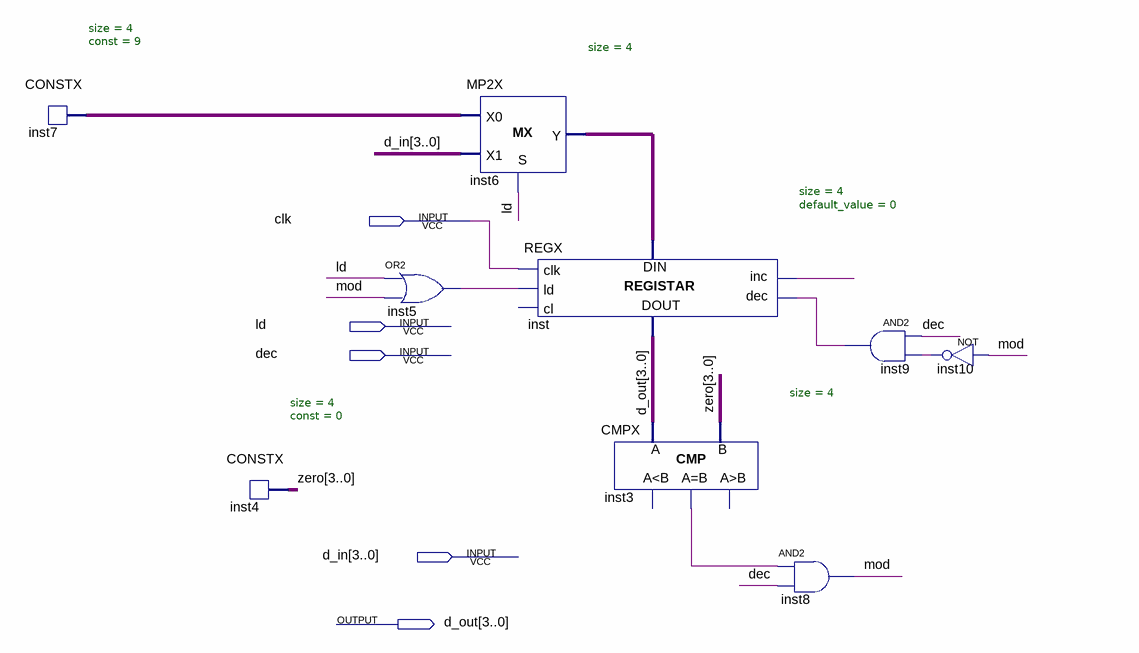
[diagram p0: schematic sheet]
// Quartus schematic RegMod9IncDec.bdf as structural Verilog: 9 symbols, 5 pins
module RegMod9IncDec (
  input  clk,
  input  ld,
  input  dec,
  input  [3:0] d_in,
  output [3:0] d_out
);

  wire inst3_eq, inst5_out, inst9_out, inst10_out, mod, undriven;
  wire [3:0] inst6_y, inst7_data, zero;

  CONSTX #(.size(4), .\const (9)) inst7 (.data(inst7_data));
  CONSTX #(.size(4), .\const (0)) inst4 (.data(zero));
  or inst5 (inst5_out, ld, mod);
  MP2X #(.size(4)) inst6 (.S(ld), .X0(inst7_data), .X1(d_in), .Y(inst6_y));
  REGX #(.size(4), .default_value(0)) inst (
    .clk(clk), .ld(inst5_out), .inc(undriven), .dec(inst9_out), .data_in(inst6_y), .data_out(d_out));  // open: cl
  CMPX #(.size(4)) inst3 (.A(d_out), .B(zero), .eq(inst3_eq));  // open: ls, gr
  and inst9 (inst9_out, dec, inst10_out);
  and inst8 (mod, inst3_eq, dec);
  not inst10 (inst10_out, mod);
endmodule
